# EAGLE design rfm12 (EAGLE 6.0)
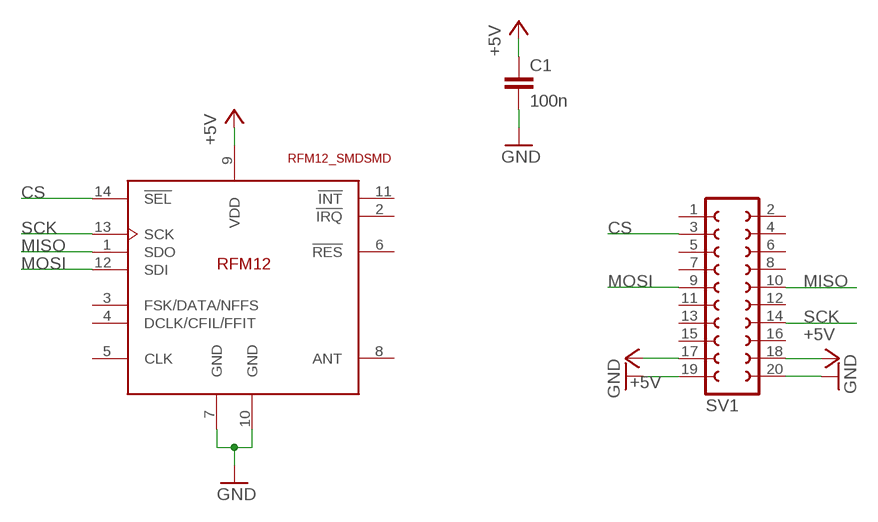
[diagram p0: schematic, sheet 1]

## Parts
C1  100n  C-EUC0805  [C0805]
SV1  FE10-2  [FE10-2]
U$1  RFM12_SMDSMD  [RFM12]

## Nets
+5V: C1.1 SV1.17 SV1.18 U$1.9(VDD)
CS: SV1.3 U$1.14(!SEL)
GND: C1.2 SV1.19 SV1.20 U$1.7(GND) U$1.10(GND)
MISO: SV1.10 U$1.1(SDO)
MOSI: SV1.9 U$1.12(SDI)
SCK: SV1.14 U$1.13(SCK)
Unconnected: SV1.1 SV1.2 SV1.4 SV1.5 SV1.6 SV1.7 SV1.8 SV1.11 SV1.12 SV1.13 SV1.15 SV1.16 U$1.2(!IRQ) U$1.3(FSK/DATA/NFFS) U$1.4(DCLK/CFIL/FFIT) U$1.5(CLK) U$1.6(!RES) U$1.8(ANT) U$1.11(!INT)

## Library data of the parts
C1 = rcl:C-EU: CAPACITOR, European symbol
SV1 = con-lsta:FE10-2: FEMALE HEADER; OC_FARNELL: unknown; OC_NEWARK: unknown
U$1 = rfm_12:RFM12_SMD: RFM12 is a low costing ISM band transceiver module implemented with unique PLL. It works signal ranges from 315/433/868/915MHZ bands, comply with FCC, ETSI regulation. The SPI interface is used to communicate with microcontroller for parameter setting.

## Board
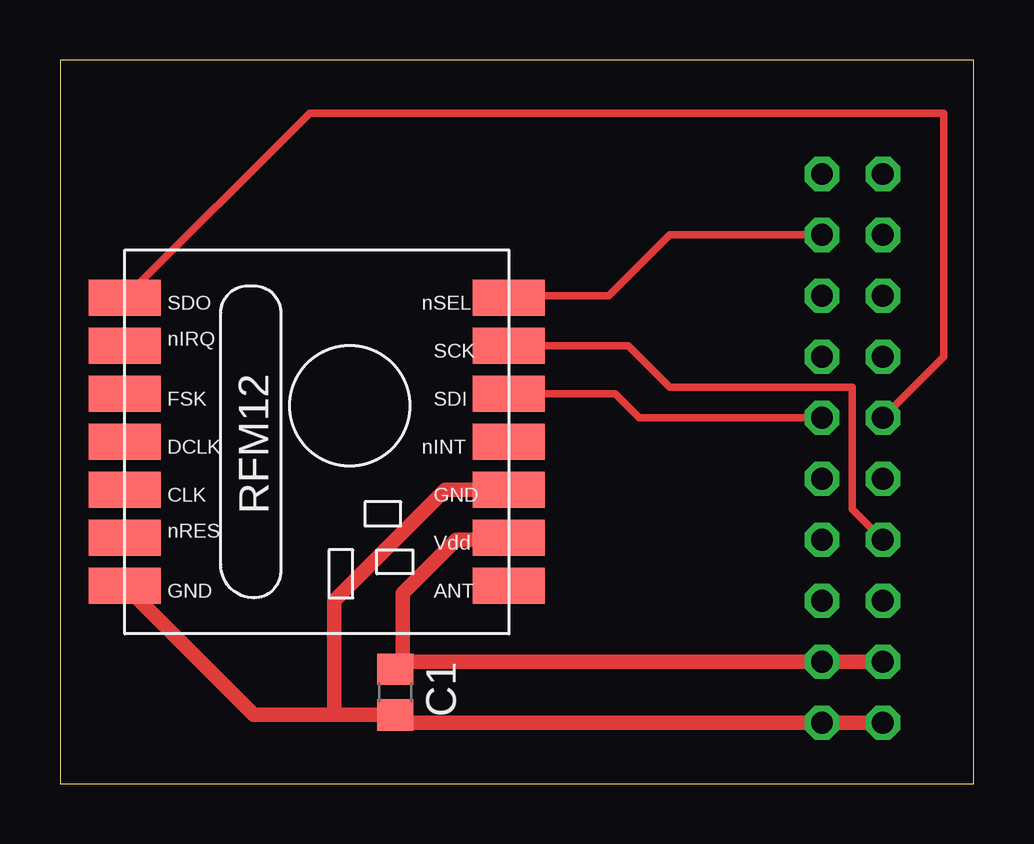
[diagram p1: board, top side]
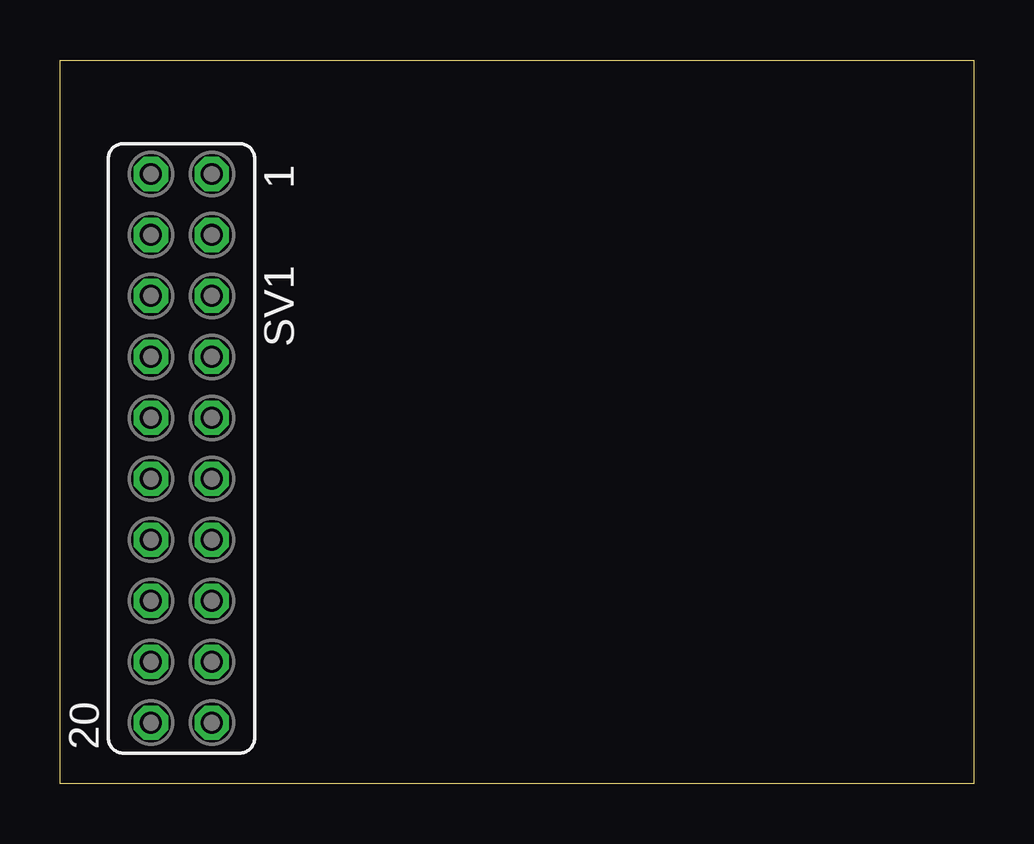
[diagram p2: board, bottom side, seen from below]

Size 38.08 x 30.15 mm. Coordinates in mm from the lower left corner, seen from the top.
Outline: 0,0 38.08,0 38.08,30.15 0,30.15 0,0
Copper layers (1*16): Top 0.035mm / dielectric 1.5mm / Bottom 0.035mm
Design rules: minimum track width 10mil, minimum drill 24mil, track to track 8mil, track to pad 8mil, pad to pad 8mil, via to via 8mil, smd to smd 8mil, copper to edge 40mil, drill to drill 8mil, minimum pad ring 10mil, minimum via ring 8mil, stop-mask expansion 4mil, vias tented up to drill 0mil, thermal gap 10mil

### Footprints (pad centres in the part's own frame; a part is rotated, then mirrored left to right if it is on the bottom)
C0805 = smd 1.3 x 1.5: 1 -0.95,0; 2 0.95,0
FE10-2 = drill 0.914 octagon: 1 -11.43,1.27; 2 -11.43,-1.27; 3 -8.89,1.27; 4 -8.89,-1.27; 5 -6.35,1.27; 6 -6.35,-1.27; 7 -3.81,1.27; 8 -3.81,-1.27; 9 -1.27,1.27; 10 -1.27,-1.27; 11 1.27,1.27; 12 1.27,-1.27; 13 3.81,1.27; 14 3.81,-1.27; 15 6.35,1.27; 16 6.35,-1.27; 17 8.89,1.27; 18 8.89,-1.27; 19 11.43,1.27; 20 11.43,-1.27
RFM12 = smd 1.5 x 3: 1 -5,-10; 2 -3,-10; 3 -1,-10; 4 1,-10; 5 3,-10; 6 5,-10; 7 7,-10; 8 7,6; 9 5,6; 10 3,6; 11 1,6; 12 -1,6; 13 -3,6; 14 -5,6

### Placement (x,y rotation side)
C1  13.97,3.81 270 top
SV1  33.02,13.97 270 bottom
U$1  12.7,15.24 270 top

### Tracks (layer width: path | path; a pad name or v marks a point on that pad's centre or on a via)
+5V
  Top 0.61: SV1.18 SV1.17 14.29,5.08 | 14.29,5.08 C1.1 | 14.29,5.08 14.29,7.94 16.51,10.16 18.62,10.16 U$1.9
CS
  Top 0.305: SV1.3 25.4,22.86 22.86,20.32 18.78,20.32 U$1.14
GND
  Top 0.406: 14.29,2.54 C1.2
  Top 0.61: SV1.20 SV1.19 13.97,2.54 C1.2 11.43,2.86 | 11.43,2.86 8.08,2.86 U$1.7 | U$1.10 16.05,12.24 11.43,7.62 11.43,2.86
MISO
  Top 0.305: SV1.10 36.83,17.78 36.83,27.94 10.4,27.94 U$1.1
MOSI
  Top 0.305: SV1.9 24.13,15.24 23.13,16.24 U$1.12
SCK
  Top 0.305: SV1.14 33.02,11.43 33.02,16.51 25.4,16.51 23.67,18.24 U$1.13